# EAGLE design SatUplink-v10 (EAGLE 5.11)
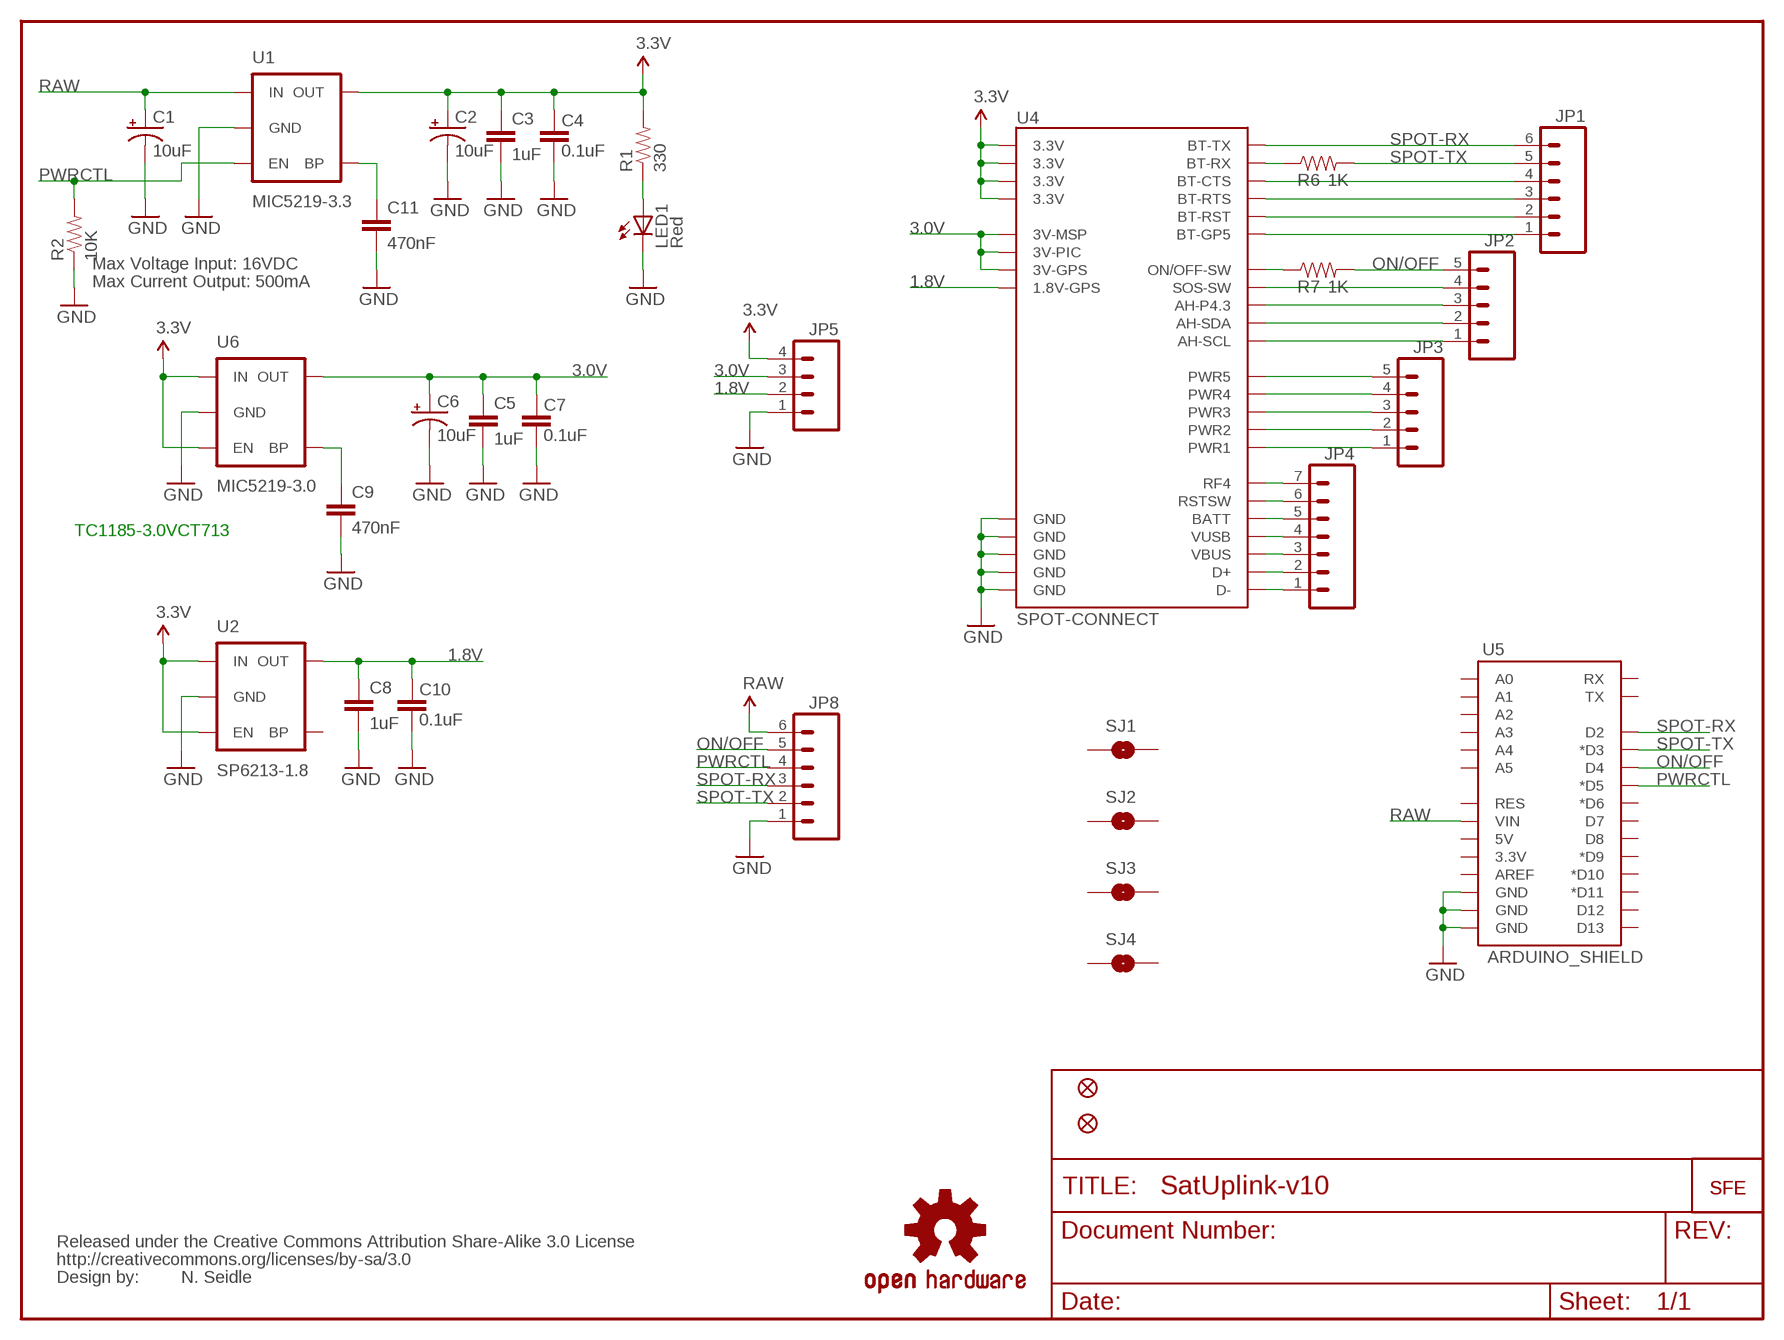
[diagram p0: schematic, sheet 1]

## Parts
C1  10uF  CAP_POL1206  [EIA3216]
C2  10uF  CAP_POL1206  [EIA3216]
C3  1uF  CAP0402-CAP  [0402-CAP]
C4  0.1uF  CAP0402-CAP  [0402-CAP]
C5  1uF  CAP0402-CAP  [0402-CAP]
C6  10uF  CAP_POL1206  [EIA3216]
C7  0.1uF  CAP0402-CAP  [0402-CAP]
C8  1uF  CAP0402-CAP  [0402-CAP]
C9  470nF  CAP0402-CAP  [0402-CAP]
C10  0.1uF  CAP0402-CAP  [0402-CAP]
C11  470nF  CAP0402-CAP  [0402-CAP]
JP1  M06SIP  [1X06]
JP2  M05PTH  [1X05]
JP3  M05PTH  [1X05]
JP4  M07  [1X07]
JP5  M04PTH  [1X04]
JP8  M06SIP  [1X06]
JP10  FIDUCIALUFIDUCIAL  [MICRO-FIDUCIAL]
JP11  FIDUCIALUFIDUCIAL  [MICRO-FIDUCIAL]
LED1  Red  LED0603  [LED-0603]
R1  330  RESISTOR0402-RES  [0402-RES]
R2  10K  RESISTOR0402-RES  [0402-RES]
R6  1K  RESISTOR0402-RES  [0402-RES]
R7  1K  RESISTOR0402-RES  [0402-RES]
SJ1  SOLDERJUMPERTRACE  [SJ_2S-TRACE]
SJ2  SOLDERJUMPERTRACE  [SJ_2S-TRACE]
SJ3  SOLDERJUMPERTRACE  [SJ_2S-TRACE]
SJ4  SOLDERJUMPERTRACE  [SJ_2S-TRACE]
U1  MIC5219-3.3  V_REG_LDOSMD  [SOT23-5]
U2  SP6213-1.8  V_REG_LDOSMD2  [SC70]
U4  SPOT-CONNECT  SPOT-CONNECTSMD  [SPOT-CONNECT]
U5  ARDUINO_SHIELD  ARDUINO_SHIELDNO_SILK  [DUEMILANOVE_VIAS]
U6  MIC5219-3.0  V_REG_LDOSMD  [SOT23-5]
U$1  LOGO-SFESK  [SFE-LOGO-FLAME]
U$2  CREATIVE_COMMONS  [CREATIVE_COMMONS]
U$3  OSHW-LOGOS  [OSHW-LOGO-S]
U$11  LOGO-SFENEW  [SFE-NEW-WEBLOGO]

## Nets
1.8V: C8.1 C10.2 JP5.2 U2.5(OUT) U4.1.8V-GPS
3.0V: C5.1 C6.A(+) C7.2 JP5.3 U4.3V-GPS U4.3VMSP(3V-MSP) U4.3VPIC(3V-PIC) U6.5(OUT)
3.3V: C2.A(+) C3.1 C4.2 JP5.4 R1.2 U1.5(OUT) U2.1(IN) U2.3(EN) U4.3.3V@1(3.3V) U4.3.3V@2(3.3V) U4.3.3V@3(3.3V) U4.3.3V@4(3.3V) U6.1(IN) U6.3(EN)
GND [vcc]: C1.C(-) C2.C(-) C3.2 C4.1 C5.2 C6.C(-) C7.1 C8.2 C9.2 C10.1 C11.2 JP5.1 JP8.1 LED1.C R2.1 U1.2(GND) U2.2(GND) U4.GND@1(GND) U4.GND@2(GND) U4.GND@3(GND) U4.GND@4(GND) U4.GND@5(GND) U5.GND@0(GND) U5.GND@1(GND) U5.GND@2(GND) U6.2(GND)
N$2: JP1.4 U4.BT-CTS
N$3: R6.1 U4.BT-RX
N$4: C9.1 U6.4(BP)
N$6: JP1.3 U4.BT-RTS
N$7: R7.1 U4.ON/OFF(ON/OFF-SW)
N$8: JP1.2 U4.BT-RST
N$9: JP1.1 U4.BT-GP5
N$10: JP3.1 U4.PWRCTL1(PWR1)
N$11: JP3.2 U4.PWRCTL2(PWR2)
N$12: JP3.3 U4.PWRCTL3(PWR3)
N$13: JP3.4 U4.PWRCTL4(PWR4)
N$14: JP3.5 U4.PWRCTL5(PWR5)
N$15: JP4.1 U4.D-
N$16: JP4.2 U4.D+
N$17: JP4.3 U4.VBUS
N$18: JP4.4 U4.VUSB
N$19: JP4.5 U4.BATT
N$20: JP4.6 U4.RSTSW
N$21: JP4.7 U4.RF4
N$22: JP2.1 U4.AH-SCL
N$23: JP2.2 U4.AH/SDA(AH-SDA)
N$24: JP2.3 U4.AH/P4.3(AH-P4.3)
N$25: JP2.4 U4.SOS(SOS-SW)
N$26: C11.1 U1.4(BP)
N$38: LED1.A R1.1
ON/OFF: JP2.5 JP8.5 R7.2 U5.D4
PWRCTL [vcc]: JP8.4 R2.2 U1.3(EN) U5.D5(*D5)
RAW [vcc]: C1.A(+) JP8.6 U1.1(IN) U5.VIN
SPOT-RX: JP1.6 JP8.3 U4.BT-TX U5.D2
SPOT-TX: JP1.5 JP8.2 R6.2 U5.D3(*D3)
Unconnected: SJ1.1 SJ1.2 SJ2.1 SJ2.2 SJ3.1 SJ3.2 SJ4.1 SJ4.2 U2.4(BP) U5.3.3V U5.5V U5.A0 U5.A1 U5.A2 U5.A3 U5.A4 U5.A5 U5.AREF U5.D6(*D6) U5.D7 U5.D8 U5.D9(*D9) U5.D10(*D10) U5.D11(*D11) U5.D12 U5.D13 U5.RES U5.RX U5.TX

## Notes on the sheet
- Max Voltage Input: 16VDC
- Max Current Output: 500mA
- TC1185-3.0VCT713
- N. Seidle

## Library data of the parts
C1 C2 C6 = SparkFun:CAP_POL: Capacitor Polarized These are standard SMD and PTH capacitors. Normally 10uF, 47uF, and 100uF in electrolytic and tantalum varieties. Always verify the external diameter of the through hole cap, it varies with capacity, voltage, and manufacturer. The EIA devices should be standard.
C3-C5 C7-C11 = SparkFun:CAP: Capacitor Standard 0603 ceramic capacitor, and 0.1" leaded capacitor.
JP1 JP8 = SparkFun:M06: Header 6 Standard 6-pin 0.1" header. Use with straight break away headers (SKU : PRT-00116), right angle break away headers (PRT-00553), swiss pins (PRT-00743), machine pins (PRT-00117), and female headers (PRT-00115). Molex polarized connector foot print use with SKU : PRT-08094 with associated crimp pins and housings. NOTES ON THE VARIANTS LOCK and LOCK_LONGPADS... This footprint was designed to help hold the alignment of a through-hole component (i.e. 6-pin header) while soldering it into place. You may notice that each hole has been shifted either up or down by 0.005 of an inch from it's more standard position (which is a perfectly straight line). This slight alteration caused the pins (the squares in the middle) to touch the edges of the holes. Because they are alternating, it causes a "brace" to hold the component in place. 0.005 has proven to be the perfect amount of "off-center" position when using our standard breakaway headers. Although looks a little odd when you look at the bare footprint, once you have a header in there, the alteration is very hard to notice. Also, if you push a header all the way into place, it is covered up entirely on the bottom side. This idea of altering the position of holes to aid alignment will be further integrated into the Sparkfun Library for other footprints. It can help hold any component with 3 or more connection pins.
JP2 JP3 = SparkFun:M05: Header 5 Standard 5-pin 0.1" header. Use with straight break away headers (SKU : PRT-00116), right angle break away headers (PRT-00553), swiss pins (PRT-00743), machine pins (PRT-00117), and female headers (PRT-00115). Molex polarized connector foot print use with SKU : PRT-08230 with associated crimp pins and housings.
JP4 = SparkFun:M07: Header 7 Standard 7-pin 0.1" header. Use with straight break away headers (SKU : PRT-00116), right angle break away headers (PRT-00553), swiss pins (PRT-00743), machine pins (PRT-00117), and female headers (PRT-00115). NOTES ON THE VARIANTS LOCK and LOCK_LONGPADS... This footprint was designed to help hold the alignment of a through-hole component (i.e. 7-pin header) while soldering it into place. You may notice that each hole has been shifted either up or down by 0.005 of an inch from it's more standard position (which is usually a perfectly straight line). This slight alteration caused the pins (the squares in the middle) to touch the edges of the holes. Because they are alternating, it causes a "brace" to hold the header in place. 0.005 has proven to be the perfect amount of "off-center" position when using our standard breakaway headers. Although looks a little odd when you look at the bare footprint, once you have a header in there, the alteration is very hard to notice. Also, if you push a header all the way into place, it is covered up entirely on the bottom side. This idea of altering the position of holes to aid alignment will be further integrated into the Sparkfun Library for other footprints. It can help hold any component with 3 or more connection pins.
JP5 = SparkFun:M04: Header 4 Standard 4-pin 0.1" header. Use with straight break away headers (SKU : PRT-00116), right angle break away headers (PRT-00553), swiss pins (PRT-00743), machine pins (PRT-00117), and female headers (PRT-00115). Molex polarized connector foot print use with SKU : PRT-08231 with associated crimp pins and housings. 1MM SMD Version SKU: PRT-10208
JP10 JP11 = SparkFun:FIDUCIAL: Fiducial Alignment Points Various fiducial points for machine vision alignment.
LED1 = SparkFun:LED: LEDs Standard schematic elements and footprints for 5mm, 3mm, 1206, and 0603 sized LEDs. 5mm - Spark Fun Electronics SKU : COM-00529 (and others)
R1 R2 R6 R7 = SparkFun:RESISTOR: Resistor Basic schematic elements and footprints for 0603, 1206, and PTH resistors.
SJ1-SJ4 = SparkFun:SOLDERJUMPER: Solder Jumper Standard SMD solder jumper. Used to automate production. Two varients : Normally Open and Normally Closed are the same, but have different paste layers. NC will have a large amount of paste and should jumper during reflow.
U1 U2 U6 = SparkFun:V_REG_LDO: Voltage Regulator LDO Standard 150mA LDO voltage regulator in SOT-23 layout. Micrel part MIC5205. BP (by-pass) pin is used to lower output noise with 470pF cap.
U4 = SparkFun:SPOT-CONNECT
U5 = SparkFun:ARDUINO_SHIELD
U$1 U$11 = SparkFun:LOGO-SFE: Spark Fun Electronics PCB Logo This is the standard Spark Fun Electronics PCB logo.
U$2 = SparkFun:CREATIVE_COMMONS
U$3 = SparkFun:OSHW-LOGO: Open Source Hardware Logo This logo indicates the piece of hardware it is found on incorporates a OSHW license and/or adheres to the definition of open source hardware found here: http://freedomdefined.org/OSHW

## Net classes
0 default: width 0.203 mm

## Board
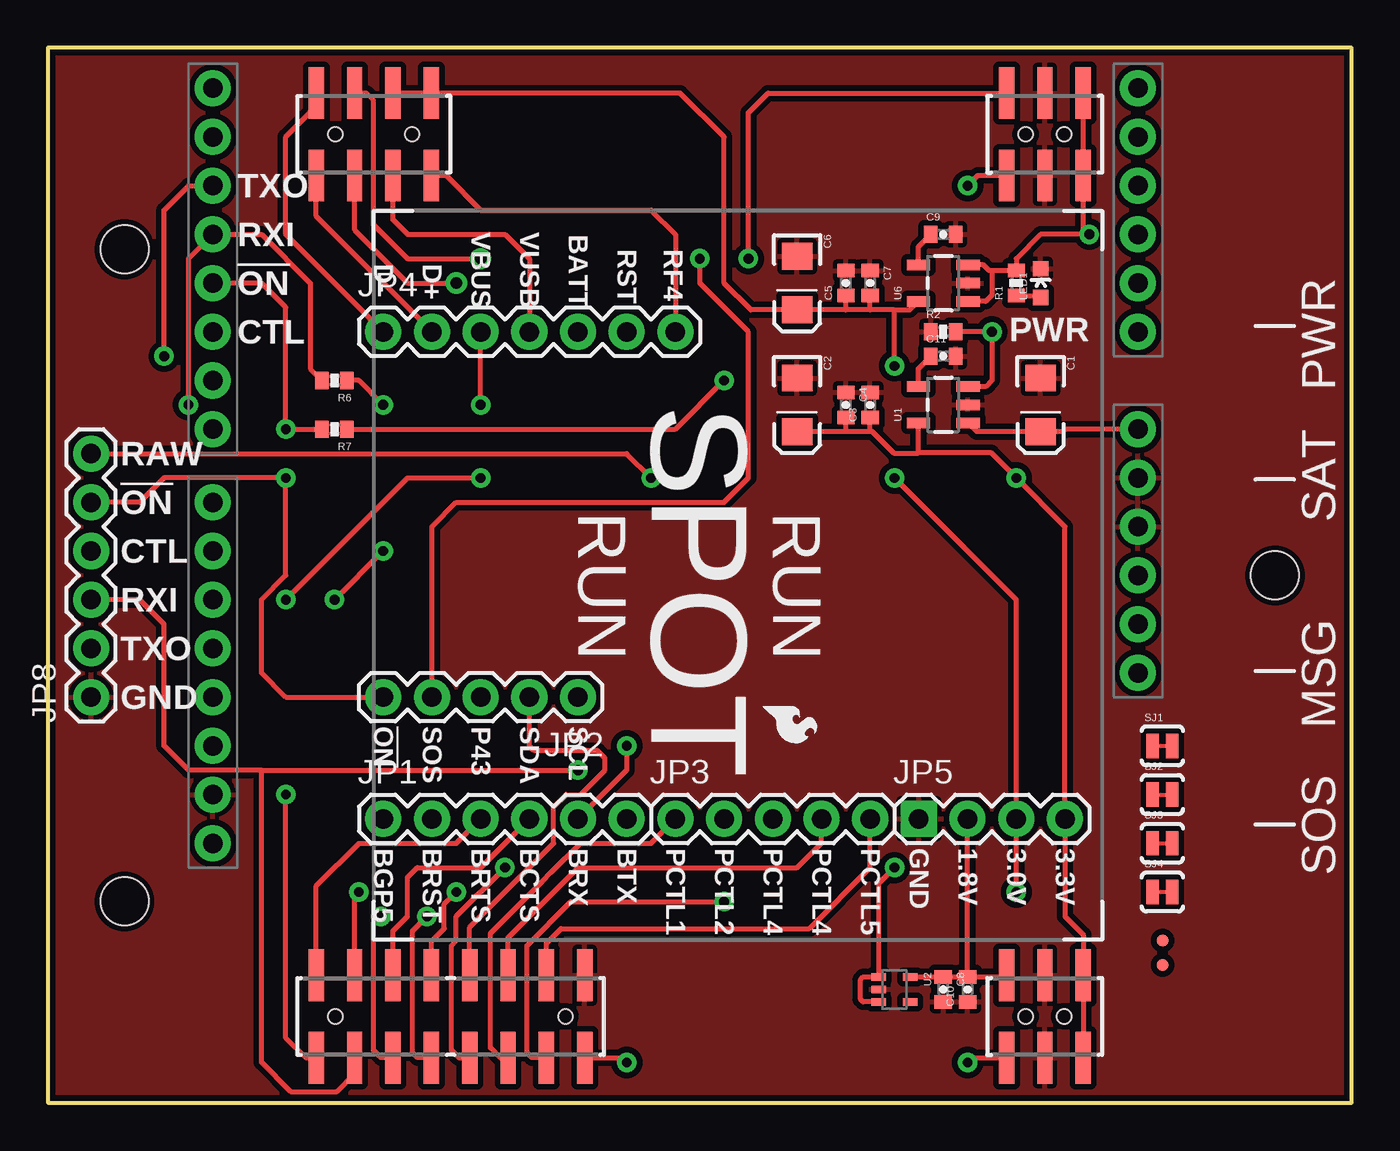
[diagram p1: board, top side]
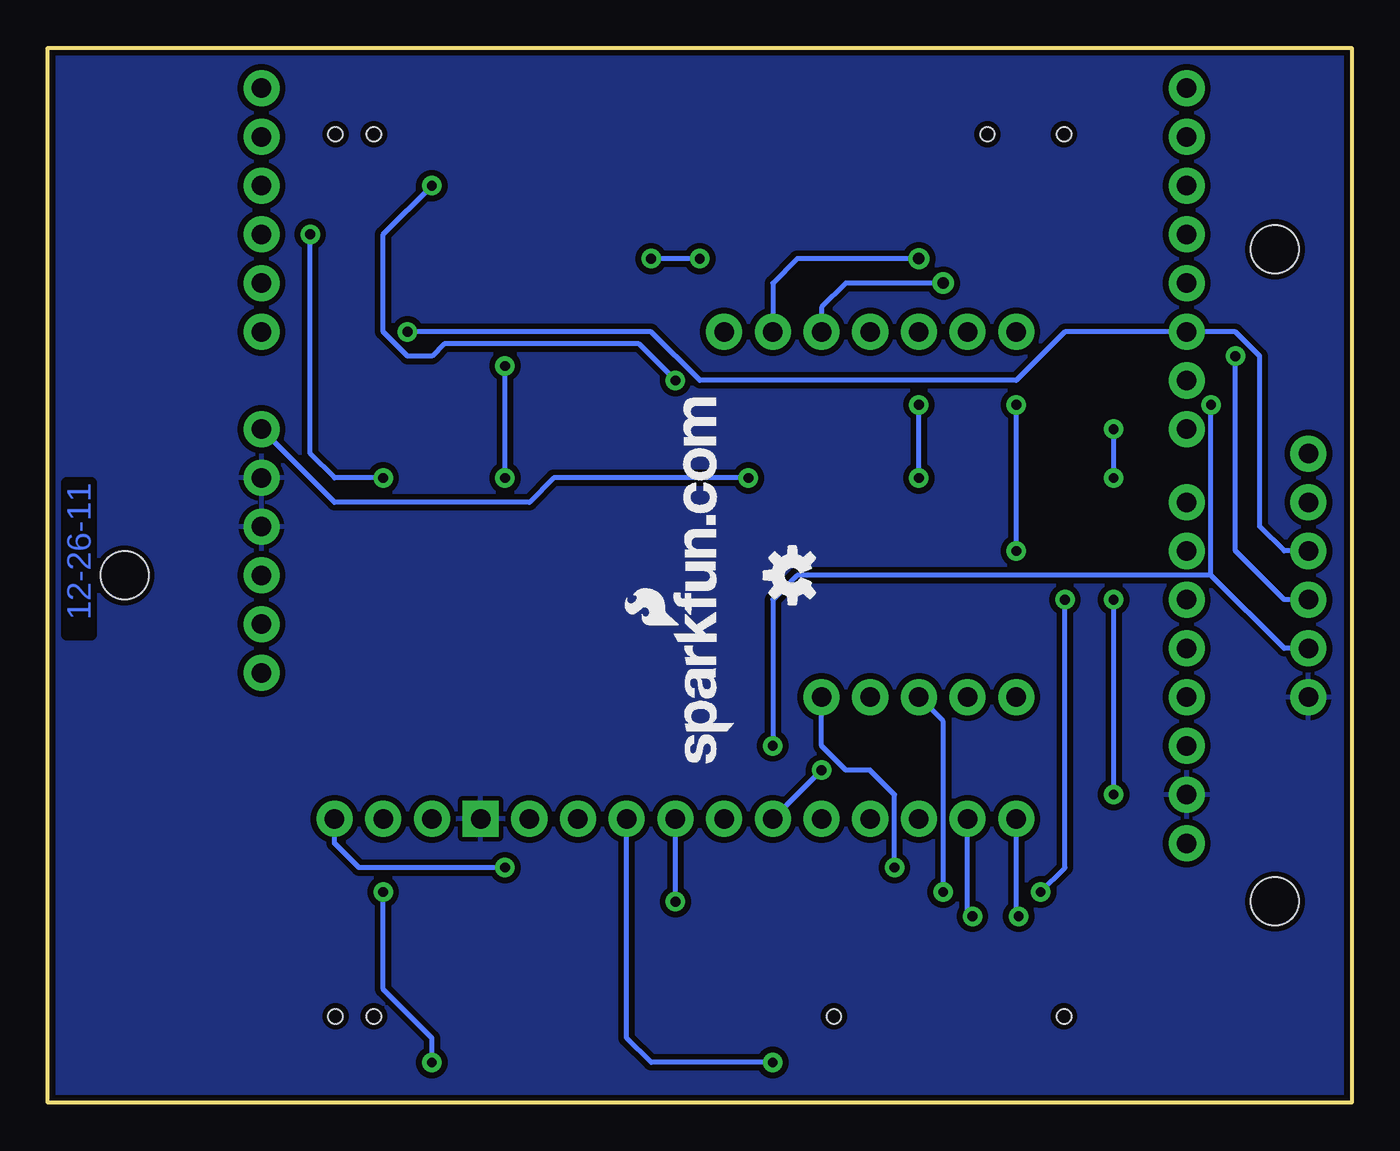
[diagram p2: board, bottom side, seen from below]

Size 68 x 55 mm. Coordinates in mm from the lower left corner, seen from the top.
Copper layers (1*16): Top 0.035mm / dielectric 1.5mm / Bottom 0.035mm
Design rules "SparkFun *": minimum track width 8mil, minimum drill 20mil, track to track 8mil, track to pad 8mil, pad to pad 8mil, via to via 8mil, smd to smd 8mil, copper to edge 10mil, drill to drill 8mil, minimum pad ring 12mil, minimum via ring 10mil, stop-mask expansion 4mil, vias tented up to drill 20mil, thermal gap 10mil

### Footprints (pad centres in the part's own frame; a part is rotated, then mirrored left to right if it is on the bottom)
EIA3216 = smd 1.4 x 1.6: A 1.4,0; C -1.4,0
0402-CAP = smd 0.7 x 0.9: 1 -0.65,0; 2 0.65,0
1X06 = drill 1.016 pad 1.88 round: 1 0,0; 2 2.54,0; 3 5.08,0; 4 7.62,0; 5 10.16,0; 6 12.7,0
1X05 = drill 1.016 pad 1.88 round: 1 0,0; 2 2.54,0; 3 5.08,0; 4 7.62,0; 5 10.16,0
1X07 = drill 1.016 pad 1.88 round: 1 0,0; 2 2.54,0; 3 5.08,0; 4 7.62,0; 5 10.16,0; 6 12.7,0; 7 15.24,0
1X04 = drill 1.016 pad 1.88 square: 1 0,0 | drill 1.016 pad 1.88 round: 2 2.54,0; 3 5.08,0; 4 7.62,0
MICRO-FIDUCIAL = smd 0.635 x 0.635: 1 0,0
LED-0603 = smd 0.8 x 0.8: A 0,-0.75; C 0,0.75
0402-RES = smd 0.7 x 0.9: 1 -0.65,0; 2 0.65,0
SJ_2S-TRACE = smd 0.635 x 1.27: 1 -0.508,0; 2 0.508,0
SOT23-5 = smd 0.55 x 1.2: 1 -0.95,-1.3; 2 0,-1.3; 3 0.95,-1.3; 4 0.95,1.3; 5 -0.95,1.3
SC70 = smd 0.4 x 0.75: 1 -0.65,-0.825; 2 0,-0.825; 3 0.65,-0.825; 4 0.65,0.825; 5 -0.65,0.825
SPOT-CONNECT = smd 2.7 x 0.8: 1.8V-GPS 20.85,16; 3.3V@1 -25.15,20; 3.3V@2 -20.85,20; 3.3V@3 20.85,20; 3.3V@4 25.15,20; 3V-GPS 25.15,16; 3VMSP -25.15,-16; 3VPIC -25.15,-14; AH-SCL 25.15,-12; AH/P4.3 20.85,-14; AH/SDA 20.85,-12; BATT -20.85,-18; BT-CTS 20.85,-16; BT-GP5 25.15,-16; BT-RST 25.15,-14; BT-RTS 20.85,-20; BT-RX 20.85,-18; BT-TX 25.15,-18; D+ -20.85,-20; D- -25.15,-20; GND@1 -25.15,18; GND@2 -20.85,18; GND@3 20.85,18; GND@4 25.15,18; GND@5 20.85,-6; ON/OFF -20.85,16; PWRCTL1 25.15,-10; PWRCTL2 25.15,-8; PWRCTL3 25.15,-6; PWRCTL4 20.85,-10; PWRCTL5 20.85,-8; RF4 -20.85,-14; RSTSW -25.15,-18; SOS -25.15,16; VBUS 25.15,-20; VUSB -20.85,-16 | hole 2.5: 0,30; 17,-30; -17,-30 | hole 0.75: 23,-19; 23,-7; -23,-15; -23,-19; -23,17; -23,19; 23,17; 23,19
DUEMILANOVE_VIAS = drill 1.016 pad 1.88 round: 3.3V 50.8,13.97; 5V 50.8,16.51; A0 50.8,29.21; A1 50.8,31.75; A2 50.8,34.29; A3 50.8,36.83; A4 50.8,39.37; A5 50.8,41.91; AREF 2.54,2.54; D2 2.54,36.83; D3 2.54,34.29; D4 2.54,31.75; D5 2.54,29.21; D6 2.54,26.67; D7 2.54,24.13; D8 2.54,20.32; D9 2.54,17.78; D10 2.54,15.24; D11 2.54,12.7; D12 2.54,10.16; D13 2.54,7.62; GND@0 50.8,19.05; GND@1 50.8,21.59; GND@2 2.54,5.08; RES 50.8,11.43; RX 2.54,41.91; TX 2.54,39.37; VIN 50.8,24.13

### Placement (x,y rotation side)
C1  51.78,36.39 270 top
C2  39.08,36.39 270 top
C3  42.89,36.39 90 top
C4  41.62,36.39 270 top
C5  41.62,42.74 90 top
C6  39.08,42.74 270 top
C7  42.89,42.74 270 top
C8  46.7,5.91 270 top
C9  46.7,45.28 0 top
C10  47.97,5.91 90 top
C11  46.7,38.93 0 top
JP1  17.49,14.8 0 top
JP2  27.65,21.15 180 top
JP3  32.73,14.8 0 top
JP4  17.49,40.2 0 top
JP5  45.43,14.8 0 top
JP8  2.25,21.15 90 top
JP10  58.13,7.18 0 top
JP11  58.13,8.45 0 top
LED1  51.78,42.74 0 top
R1  50.51,42.74 90 top
R2  46.7,40.2 0 top
R6  14.95,37.66 180 top
R7  14.95,35.12 180 top
SJ1  58.13,18.61 0 top
SJ2  58.13,16.07 0 top
SJ3  58.13,13.53 0 top
SJ4  58.13,10.99 0 top
U1  46.7,36.39 90 top
U2  44.16,5.91 270 top
U4  34,27.5 270 top
U5  6.06,10.99 0 top
U6  46.7,42.74 90 top
U$1  37.3,20.64 270 top
U$2  2.25,-11.87 0 top  (outside the outline)
U$3  29.17,27.5 90 bottom
U$11  32.22,17.72 90 bottom

### Tracks (layer width: path | path; a pad name or v marks a point on that pad's centre or on a via)
1.8V
  Top 0.254: U2.5 C8.1 C10.2 | C10.2 JP5.2 | C10.2 49.91,6.56 U4.1.8V-GPS
3.0V  (via drill 0.51)
  Top 0.254: 41.62,41.34 C6.A 36.67,41.34 35.27,42.74 35.27,50.36 32.98,52.65 U4.3VPIC U4.3VMSP | 42.89,41.34 41.62,41.34 | 44.16,41.34 42.89,41.34 | 44.16,41.34 44.95,41.34 U6.5 | 42.89,41.34 C7.2 | 41.62,41.34 C5.1 | v50.51,10.99 JP5.3 50.51,26.23 v44.16,32.58 | U4.3V-GPS 48.22,2.35 v47.97,2.1 | v44.16,38.42 44.16,41.34
  Bottom 0.254: v50.51,10.99 50.51,5.91 47.97,3.37 v47.97,2.1 | v44.16,32.58 v44.16,38.42
3.3V  (via drill 0.51)
  Top 0.254: U6.1 48.92,41.79 49.24,42.1 49.24,43.39 | U6.3 48.8,43.69 49.1,43.39 49.24,43.39 | 49.24,43.39 R1.2 50.51,44.01 51.78,45.28 v54.32,45.28 54,45.6 U4.3.3V@2 U4.3.3V@1 | 41.62,34.99 C2.A | 42.89,34.99 41.62,34.99 | 42.89,34.99 C3.1 | 41.62,34.99 C4.2 | U2.3 42.52,5.26 42.38,5.4 42.38,6.42 42.52,6.56 U2.1 43.33,11.43 v44.16,12.26 | U4.3.3V@4 U4.3.3V@3 54,8.77 53.05,9.72 JP5.4 53.05,30.04 v50.51,32.58 49.21,33.88 45.4,33.88 | 45.4,33.88 U1.5 | 42.89,34.99 43.02,34.99 44.16,33.85 45.37,33.85 45.4,33.88
  Bottom 0.254: JP5.4 53.05,13.53 51.78,12.26 v44.16,12.26 | v54.32,45.28 54.32,33.85 53.05,32.58 v50.51,32.58
GND
  pour Top (isolate 0.305): -0.29,55.44 68.29,55.44 68.29,-0.44 -0.29,-0.44
  pour Bottom (isolate 0.305): -0.29,55.44 68.29,55.44 68.29,-0.44 -0.29,-0.44
N$2
  Top 0.254: U4.BT-CTS 18,8.96 18.76,9.72 18.76,11.75 19.27,12.26 22.57,12.26 JP1.4
N$3  (via drill 0.51)
  Top 0.254: R6.1 16.22,37.66 v17.49,36.39 | v14.95,26.23 v17.49,28.77 | U4.BT-RX 16,10.77 v16.22,10.99
  Bottom 0.254: v17.49,28.77 v17.49,36.39 | v14.95,26.23 14.95,12.26 v16.22,10.99
N$4
  Top 0.254: U6.4 45.4,44.63 C9.1
N$6
  Top 0.254: JP1.3 21.3,13.53 16.22,13.53 14,11.31 U4.BT-RTS
N$7  (via drill 0.51)
  Top 0.254: R7.1 32.73,35.12 v35.27,37.66 | U4.ON/OFF 48.5,48.35 v47.97,47.82
  Bottom 0.254: v47.97,47.82 50.51,45.28 50.51,40.2 49.24,38.93 47.97,38.93 47.33,39.56 37.17,39.56 v35.27,37.66
N$8  (via drill 0.51)
  Top 0.254: U4.BT-RST 19.27,2.35 19.01,2.61 19.01,8.96 v19.78,9.72
  Bottom 0.254: JP1.2 20.03,9.97 v19.78,9.72
N$9  (via drill 0.51)
  Top 0.254: U4.BT-GP5 17.37,2.35 16.98,2.73 16.98,9.34 v17.36,9.72
  Bottom 0.254: JP1.1 17.49,9.85 v17.36,9.72
N$10
  Top 0.254: U4.PWRCTL1 23.59,2.35 23.08,2.86 23.08,8.83 25.81,11.56 26.25,12.01 27.78,13.53 31.46,13.53 JP3.1
N$11  (via drill 0.51)
  Top 0.254: U4.PWRCTL2 25.24,2.35 24.98,2.61 24.98,8.2 27.27,10.48 v35.27,10.48
  Bottom 0.254: v35.27,10.48 JP3.2
N$12  (via drill 0.51)
  Top 0.254: U4.PWRCTL3 29.94,2.35 v30.19,2.1
  Bottom 0.254: v30.19,2.1 36.54,2.1 37.81,3.37 JP3.3
N$13
  Top 0.254: U4.PWRCTL4 24,8.61 27.65,12.26 39.08,12.26 40.35,13.53 JP3.4
N$14
  Top 0.254: JP3.5 42.89,12.26 39.72,9.08 26.76,9.08 26,8.32 U4.PWRCTL5
N$15
  Top 0.254: U4.D- 14,51.95 12.41,50.36 12.41,45.28 JP4.1
N$16
  Top 0.254: U4.D+ 14,46.23 JP4.2
N$17  (via drill 0.51)
  Top 0.254: U4.VBUS 13.43,2.35 12.41,3.37 v12.41,16.07 | v12.41,26.23 18.76,32.58 v22.57,32.58 | v22.57,36.39 JP4.3
  Bottom 0.254: v12.41,16.07 v12.41,26.23 | v22.57,32.58 v22.57,36.39
N$18
  Top 0.254: U4.VUSB 18,46.04 18.76,45.28 23.84,45.28 25.11,44.01 JP4.4
N$19  (via drill 0.6)
  Top 0.254: U4.BATT 16,45.5 18.76,42.74 v21.3,42.74
  Bottom 0.254: v21.3,42.74 26.38,42.74 27.65,41.47 JP4.5
N$20  (via drill 0.6)
  Top 0.254: U4.RSTSW 16.6,52.65 16.98,52.27 16.98,45.79 18.76,44.01 v22.57,44.01
  Bottom 0.254: v22.57,44.01 28.92,44.01 30.19,42.74 JP4.6
N$21
  Top 0.254: U4.RF4 20.77,48.35 22.57,46.55 31.46,46.55 32.73,45.28 JP4.7
N$22  (via drill 0.51)
  Top 0.254: U4.AH-SCL 21.43,2.35 21.05,2.73 21.05,8.2 21.3,8.45 21.3,9.72 v23.84,12.26
  Bottom 0.254: v23.84,12.26 23.84,16.07 25.11,17.34 26.38,17.34 27.65,18.61 JP2.1
N$23
  Top 0.254: JP2.2 25.11,18.61 25.36,18.36 28.67,18.36 29.05,17.97 29.05,17.34 27.78,16.07 27.01,16.07 26.38,15.43 26.38,13.53 22,9.15 U4.AH/SDA
N$24  (via drill 0.51)
  Top 0.254: U4.AH/P4.3 20,8.42 20.66,9.08 20.66,10.35 v21.3,10.99
  Bottom 0.254: v21.3,10.99 21.3,19.88 JP2.3
N$25  (via drill 0.51)
  Top 0.254: U4.SOS 37.56,52.65 36.54,51.63 v36.54,44.01 | v34,44.01 34,42.74 36.54,40.2 36.54,32.58 35.27,31.31 21.3,31.31 20.03,30.04 JP2.4
  Bottom 0.254: v34,44.01 v36.54,44.01
N$26
  Top 0.254: U1.4 45.4,38.28 C11.1
N$38
  Top 0.254: R1.1 51.68,42.09 LED1.A
ON/OFF  (via drill 0.51)
  Top 0.254: U5.D4 11.14,42.74 12.41,41.47 v12.41,35.12 R7.2 | JP8.5 4.79,31.31 6.06,32.58 v12.41,32.58 12.41,27.5 11.14,26.23 11.14,22.42 12.41,21.15 JP2.5
  Bottom 0.254: v12.41,32.58 v12.41,35.12
PWRCTL  (via drill 0.51)
  Top 0.254: U1.3 48.92,37.34 49.24,37.66 v49.24,40.2 R2.2
  Bottom 0.254: v49.24,40.2 36.54,40.2 34,37.66 17.49,37.66 14.95,40.2 U5.D5 6.06,40.2 4.79,38.93 4.79,30.04 3.52,28.77 JP8.4
RAW  (via drill 0.51)
  Top 0.254: U1.1 48.45,34.99 C1.A 52.92,34.99 53.05,35.12 U5.VIN | JP8.6 30.19,33.85 v31.46,32.58
  Bottom 0.254: v31.46,32.58 41.62,32.58 42.89,31.31 53.05,31.31 U5.VIN
SPOT-RX  (via drill 0.51)
  Top 0.254: U4.BT-TX 16,1.5 15.08,0.58 12.66,0.58 11.14,2.1 11.14,17.34 | v6.06,38.93 6.06,46.55 7.33,47.82 U5.D2 | JP8.3 4.79,26.23 6.06,24.96 6.06,18.61 7.33,17.34 11.14,17.34 | 11.14,17.34 v27.65,17.34
  Bottom 0.254: v27.65,17.34 JP1.6 | JP8.3 3.52,26.23 6.06,28.77 v6.06,38.93
SPOT-TX  (via drill 0.51)
  Top 0.254: R6.2 13.68,38.28 13.68,42.74 11.14,45.28 U5.D3 7.33,44.01 v7.33,36.39 | v30.19,18.61 30.19,17.34 JP1.5
  Bottom 0.254: JP8.2 3.52,23.69 7.33,27.5 | 7.33,27.5 v7.33,36.39 | 7.33,27.5 28.92,27.5 30.19,26.23 v30.19,18.61

### Text on the board
Bottom: 12-26-11
tPlace: TXO | VBUS | VUSB | BATT | RXI | RST | RF4 | D- | D+ | !ON | CTL | PWR | RAW | !ON | CTL | RXI | TXO | GND | !ON | SOS | P43 | SDA | SCL | BGP5 | BRST | BRTS | BCTS | BRX | BTX | PCTL1 | PCTL2 | PCTL4 | PCTL4 | PCTL5 | GND | 1.8V | 3.0V | 3.3V | N. Seidle